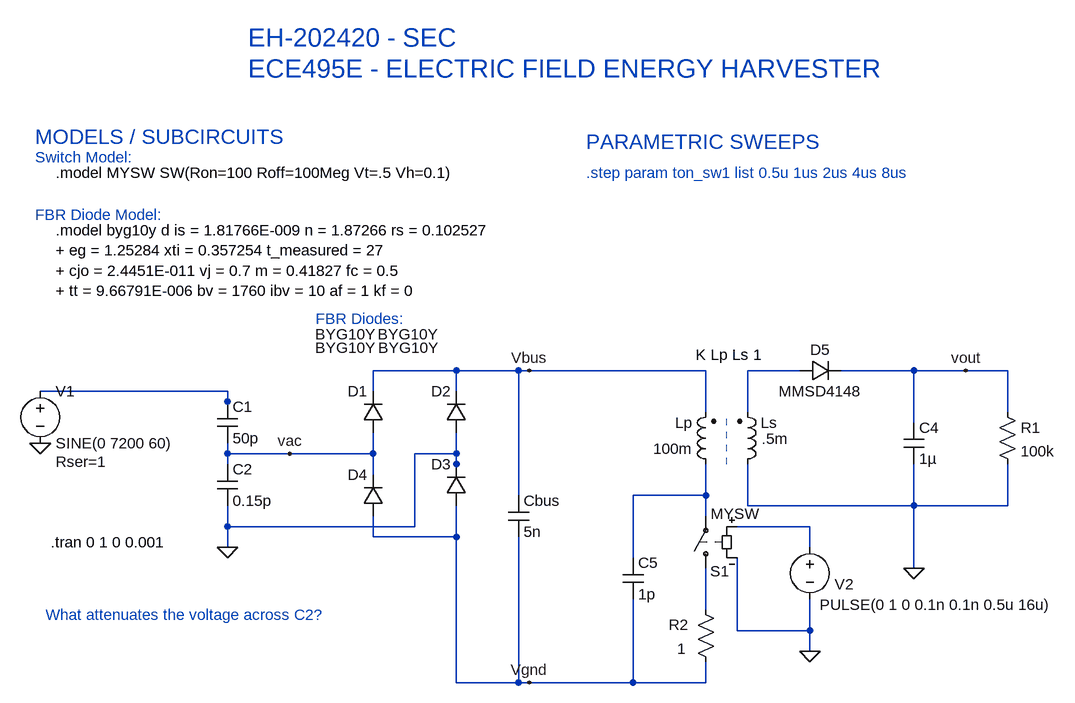
[diagram p0: schematic rodriguez-topology.asc]
rodriguez-topology.asc, the LTspice schematic file:
Version 4
SHEET 1 3692 2544
WIRE 752 128 624 128
WIRE 848 128 752 128
WIRE 864 128 848 128
WIRE 1136 128 864 128
WIRE 1280 128 1200 128
WIRE 1456 128 1344 128
WIRE 1536 128 1456 128
WIRE 1600 128 1536 128
WIRE 400 160 112 160
WIRE 624 160 624 128
WIRE 752 160 752 128
WIRE 400 176 400 160
WIRE 400 192 400 176
WIRE 1136 192 1136 128
WIRE 1200 192 1200 128
WIRE 1600 192 1600 128
WIRE 1456 208 1456 128
WIRE 400 256 400 240
WIRE 496 256 400 256
WIRE 624 256 624 224
WIRE 624 256 496 256
WIRE 752 256 752 224
WIRE 752 256 688 256
WIRE 400 272 400 256
WIRE 752 272 752 256
WIRE 624 288 624 256
WIRE 752 288 752 272
WIRE 848 320 848 128
WIRE 1136 320 1136 272
WIRE 1136 320 1024 320
WIRE 1200 336 1200 272
WIRE 1456 336 1456 272
WIRE 1456 336 1200 336
WIRE 1600 336 1600 272
WIRE 1600 336 1456 336
WIRE 1136 352 1136 320
WIRE 400 368 400 336
WIRE 688 368 688 256
WIRE 688 368 400 368
WIRE 1296 368 1184 368
WIRE 624 384 624 352
WIRE 752 384 752 336
WIRE 752 384 624 384
WIRE 400 400 400 368
WIRE 1296 400 1296 368
WIRE 1024 416 1024 320
WIRE 1456 432 1456 336
WIRE 1136 496 1136 432
WIRE 1184 528 1184 416
WIRE 1296 528 1296 480
WIRE 1296 528 1184 528
WIRE 1296 560 1296 528
WIRE 752 608 752 384
WIRE 848 608 848 384
WIRE 848 608 752 608
WIRE 864 608 848 608
WIRE 1024 608 1024 480
WIRE 1024 608 864 608
WIRE 1136 608 1136 576
WIRE 1136 608 1024 608
FLAG 112 240 0
FLAG 400 400 0
FLAG 864 128 Vbus
FLAG 864 608 Vgnd
FLAG 496 256 vac
FLAG 1536 128 vout
FLAG 1296 560 0
FLAG 1456 432 0
SYMBOL voltage 112 144 R0
WINDOW 123 0 0 Left 0
WINDOW 39 24 124 Left 2
SYMATTR SpiceLine Rser=1
SYMATTR InstName V1
SYMATTR Value SINE(0 7200 60)
SYMBOL cap 384 176 R0
SYMATTR InstName C1
SYMATTR Value 50p
SYMBOL cap 384 272 R0
SYMATTR InstName C2
SYMATTR Value 0.15p
SYMBOL cap 832 320 R0
SYMATTR InstName Cbus
SYMATTR Value 5n
SYMBOL ind2 1152 288 R180
WINDOW 0 36 80 Left 2
WINDOW 3 36 40 Left 2
SYMATTR InstName Lp
SYMATTR Value 100m
SYMATTR Type ind
SYMATTR SpiceLine Rser=3
SYMBOL ind2 1184 288 M180
WINDOW 0 36 80 Left 2
WINDOW 3 38 55 Left 2
SYMATTR InstName Ls
SYMATTR Value .5m
SYMATTR Type ind
SYMATTR SpiceLine Rser=0.2
SYMBOL res 1584 176 R0
SYMATTR InstName R1
SYMATTR Value 100k
SYMBOL voltage 1296 384 R0
WINDOW 123 0 0 Left 0
WINDOW 39 0 0 Left 0
WINDOW 3 15 104 Left 2
WINDOW 0 38 73 Left 2
SYMATTR Value PULSE(0 1 0 0.1n 0.1n 0.5u 16u)
SYMATTR InstName V2
SYMBOL cap 1440 208 R0
SYMATTR InstName C4
SYMATTR Value 1µ
SYMBOL diode 640 224 R180
WINDOW 0 24 64 Left 2
WINDOW 3 -85 131 Left 2
SYMATTR InstName D1
SYMATTR Value BYG10Y
SYMBOL diode 768 224 R180
WINDOW 0 24 64 Left 2
WINDOW 3 140 131 Left 2
SYMATTR InstName D2
SYMATTR Value BYG10Y
SYMBOL diode 768 336 R180
WINDOW 0 24 64 Left 2
WINDOW 3 140 264 Left 2
SYMATTR InstName D3
SYMATTR Value BYG10Y
SYMBOL diode 640 352 R180
WINDOW 0 24 64 Left 2
WINDOW 3 -84 280 Left 2
SYMATTR InstName D4
SYMATTR Value BYG10Y
SYMBOL diode 1280 144 R270
WINDOW 0 32 32 VTop 2
WINDOW 3 0 32 VBottom 2
SYMATTR InstName D5
SYMATTR Value MMSD4148
SYMBOL sw 1136 448 R180
WINDOW 0 -36 11 Left 2
WINDOW 3 -82 100 Left 2
SYMATTR InstName S1
SYMATTR Value MYSW
SYMBOL res 1120 480 R0
WINDOW 0 -41 39 Left 2
WINDOW 3 -28 76 Left 2
SYMATTR InstName R2
SYMATTR Value 1
SYMBOL cap 1008 416 R0
SYMATTR InstName C5
SYMATTR Value 1p
TEXT 128 392 Left 2 !.tran 0 1 0 0.001
TEXT 1120 104 Left 2 !K Lp Ls 1
TEXT 136 -176 Left 2 !.model MYSW SW(Ron=100 Roff=100Meg Vt=.5 Vh=0.1)
TEXT 952 -176 Left 2 ;.step param ton_sw1 list 0.5u 1us 2us 4us 8us
TEXT 136 -88 Left 2 !.model byg10y d is = 1.81766E-009 n = 1.87266 rs = 0.102527\n+ eg = 1.25284 xti = 0.357254 t_measured = 27\n+ cjo = 2.4451E-011 vj = 0.7 m = 0.41827 fc = 0.5\n+ tt = 9.66791E-006 bv = 1760 ibv = 10 af = 1 kf = 0
TEXT 104 -232 Left 3 ;MODELS / SUBCIRCUITS
TEXT 432 -384 Left 4 ;EH-202420 - SEC
TEXT 120 504 Left 2 ;What attenuates the voltage across C2?
TEXT 432 -336 Left 4 ;ECE495E - ELECTRIC FIELD ENERGY HARVESTER
TEXT 536 48 Left 2 ;FBR Diodes:
TEXT 104 -112 Left 2 ;FBR Diode Model:
TEXT 104 -200 Left 2 ;Switch Model:
TEXT 952 -224 Left 3 ;PARAMETRIC SWEEPS
LINE Normal 1168 272 1168 192 2

The netlist it stands for:
* rodriguez-topology.asc
V1 N002 0 SINE(0 7200 60) Rser=1
C1 N002 vac 50p
C2 vac 0 0.15p
Cbus Vbus Vgnd 5n
Lp N003 Vbus 100m Rser=3
Ls 0 N001 .5m Rser=0.2
R1 vout 0 100k
V2 N004 0 PULSE(0 1 0 0.1n 0.1n 0.5u 16u)
C4 vout 0 1µ
D1 vac Vbus BYG10Y
D2 0 Vbus BYG10Y
D3 Vgnd 0 BYG10Y
D4 Vgnd vac BYG10Y
D5 N001 vout MMSD4148
S1 N005 N003 N004 0 MYSW
R2 N005 Vgnd 1
C5 N003 Vgnd 1p
.model D D
.lib standard.dio
.tran 0 1 0 0.001
K Lp Ls 1
.model MYSW SW(Ron=100 Roff=100Meg Vt=.5 Vh=0.1)
* .step param ton_sw1 list 0.5u 1us 2us 4us 8us
.model byg10y d is = 1.81766E-009 n = 1.87266 rs = 0.102527
+ eg = 1.25284 xti = 0.357254 t_measured = 27
+ cjo = 2.4451E-011 vj = 0.7 m = 0.41827 fc = 0.5
+ tt = 9.66791E-006 bv = 1760 ibv = 10 af = 1 kf = 0
* MODELS / SUBCIRCUITS
* EH-202420 - SEC
* What attenuates the voltage across C2?
* ECE495E - ELECTRIC FIELD ENERGY HARVESTER
* FBR Diodes:
* FBR Diode Model:
* Switch Model:
* PARAMETRIC SWEEPS
.backanno
.end